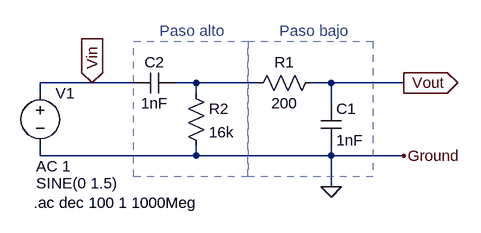
[diagram p0: schematic Filtro RC paso banda.asc]
Filtro RC paso banda.asc, the LTspice schematic file:
Version 4
SHEET 1 880 680
WIRE -112 112 -192 112
WIRE -48 112 -112 112
WIRE 48 112 16 112
WIRE 144 112 48 112
WIRE 256 112 224 112
WIRE 368 112 256 112
WIRE -192 128 -192 112
WIRE 48 128 48 112
WIRE 256 144 256 112
WIRE -192 224 -192 208
WIRE 48 224 48 208
WIRE 48 224 -192 224
WIRE 256 224 256 208
WIRE 256 224 48 224
WIRE 368 224 256 224
WIRE 256 272 256 224
FLAG 256 272 0
FLAG 368 112 Vout
IOPIN 368 112 Out
FLAG -112 112 Vin
IOPIN -112 112 In
FLAG 368 224 Ground
SYMBOL res 240 96 R90
WINDOW 0 0 56 VBottom 2
WINDOW 3 32 56 VTop 2
SYMATTR InstName R1
SYMATTR Value 200
SYMBOL cap 240 144 R0
SYMATTR InstName C1
SYMATTR Value 1nF
SYMBOL voltage -192 112 R0
WINDOW 3 -6 154 Left 2
WINDOW 123 -6 128 Left 2
WINDOW 39 0 0 Left 0
SYMATTR InstName V1
SYMATTR Value SINE(0 1.5)
SYMATTR Value2 AC 1
SYMBOL cap 16 96 R90
WINDOW 0 0 32 VBottom 2
WINDOW 3 32 32 VTop 2
SYMATTR InstName C2
SYMATTR Value 1nF
SYMBOL res 32 112 R0
SYMATTR InstName R2
SYMATTR Value 16k
TEXT -202 296 Left 2 !.ac dec 100 1 1000Meg
TEXT -8 32 Left 2 ;Paso alto
TEXT 176 32 Left 2 ;Paso bajo
RECTANGLE Normal 128 256 -48 48 2
RECTANGLE Normal 320 256 128 48 2

The netlist it stands for:
* Filtro RC paso banda.asc
R1 Vout N001 200
C1 Vout 0 1nF
V1 Vin 0 SINE(0 1.5) AC 1
C2 N001 Vin 1nF
R2 N001 0 16k
.ac dec 100 1 1000Meg
* Paso alto
* Paso bajo
.backanno
.end